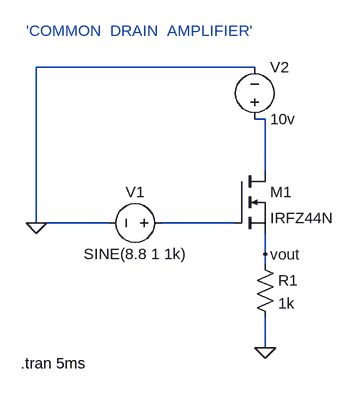
[diagram p0: schematic 11.Common Drain Amplifier.asc]
11.Common Drain Amplifier.asc, the LTspice schematic file:
Version 4
SHEET 1 880 680
WIRE 208 -80 -128 -80
WIRE 224 0 208 0
WIRE 224 80 224 0
WIRE -128 160 -128 -80
WIRE -16 160 -128 160
WIRE 176 160 64 160
WIRE 224 208 224 176
WIRE 224 224 224 208
WIRE 224 352 224 304
FLAG -128 160 0
FLAG 224 352 0
FLAG 224 208 vout
SYMBOL nmos 176 80 R0
SYMATTR InstName M1
SYMATTR Value IRFZ44N
SYMBOL res 208 208 R0
SYMATTR InstName R1
SYMATTR Value 1k
SYMBOL voltage 80 160 R90
WINDOW 0 -32 56 VBottom 2
WINDOW 3 32 56 VTop 2
WINDOW 123 60 56 VTop 2
WINDOW 39 0 0 Left 0
SYMATTR InstName V1
SYMATTR Value SINE(8.8 1 1k)
SYMBOL voltage 208 16 M180
WINDOW 0 24 96 Left 2
WINDOW 3 24 16 Left 2
WINDOW 123 0 0 Left 0
WINDOW 39 0 0 Left 0
SYMATTR InstName V2
SYMATTR Value 10v
TEXT -152 376 Left 2 !.tran 5ms
TEXT -144 -136 Left 2 ;'COMMON  DRAIN  AMPLIFIER'

The netlist it stands for:
* 11.Common Drain Amplifier.asc
M1 N001 N002 vout vout IRFZ44N
R1 vout 0 1k
V1 N002 0 SINE(8.8 1 1k)
V2 N001 0 10v
.model NMOS NMOS
.model PMOS PMOS
.lib standard.mos
.tran 5ms
* 'COMMON  DRAIN  AMPLIFIER'
.backanno
.end